# Altium schematic sheet RelayBypass.SchDoc
size A4; Author: Jeremiah Lilland; CompanyName: Pinebox Effects; DrawnBy: Jeremiah Lilland; Revision: 1.0
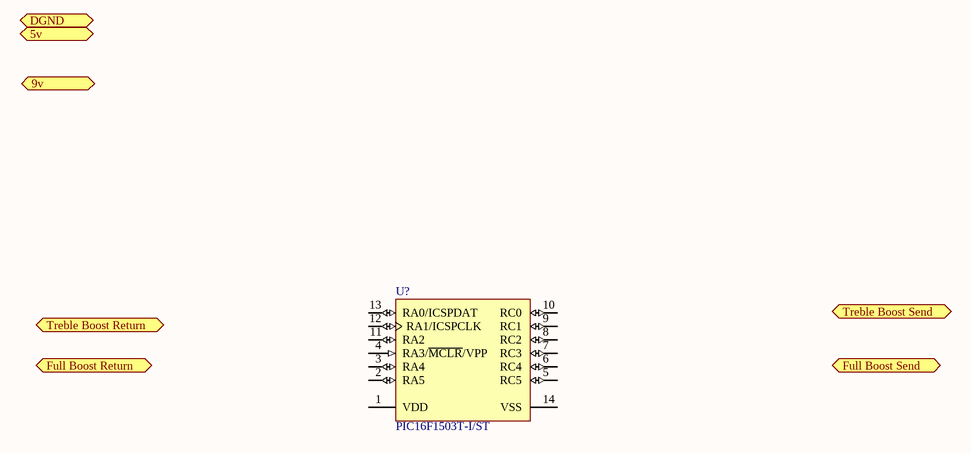
[diagram p0: RelayBypass.SchDoc]

## Parts
U?  PIC16F1503T-I/ST  [MCHP-TSSOP-ST14_N]

## Ports
5v, 9v (bidir), DGND, Full Boost Return (in), Full Boost Send (out), Treble Boost Return (in), Treble Boost Send (out)

## Nets

Not connected (* = marked no-connect by the designer): U? 1(VDD) 2(RA5) 3(RA4) 4(RA3/~{MCLR}/VPP) 5(RC5) 6(RC4) 7(RC3) 8(RC2) 9(RC1) 10(RC0) 11(RA2) 12(RA1/ICSPCLK) 13(RA0/ICSPDAT) 14(VSS)

## Notes on the sheet
- Sheet Title:
- Project Title:
- Date:
- Revision:
- Sheet
- of
- File:

## Library data of the parts
U? = PIC16F1503T-I/ST: Flash, 8-Bit Microcontroller, 20 MHz, 11 I/O, -40 to 85 degC, 14-pin TSSOP (ST14), Tape and Reel; Manufacturer: Microchip; # of A/D Channels: 8; Digital Communication: 1 -MSSP(SPI/I2C); I/O Pins: 11; Internal Oscillator: 16 MHz, 31 kHz; Max. CPU Speed MHz: 20; Operation Voltage Range: 2.3V - 5.5V; Packing: T/R; Program Memory KBytes: 3.5; Program Memory KWords: 2; RAM: 128; Timers: 2 - 8-bit, 1 - 16-bit; DatasheetVersion: Rev. A; PackageVersion: C04-087C, 12/2012; PackageReference: TSSOP-ST14; PackageDescription: 14-Lead Plastic Thin Shrink Small Outline, 5 x 4.4 mm Body, 0.65 mm Pitch; Supplier 1: Digi-Key; Supplier Part Number 1: PIC16F1503T-I/ST-ND; Supplier 2: Newark; Supplier Part Number 2: 55T3638; Supplier 3: Mouser; Supplier Part Number 3: 579-PIC16F1503T-I/ST; Memory Type: Flash; RoHS: TRUE; Mounting Technology: Surface Mount; PartNumber: PIC16F1503T-I/ST; ComponentLink1Description: Datasheet; ComponentLink1URL: http://ww1.microchip.com/downloads/en/DeviceDoc/41607A.pdf; ComponentLink2Description: Package Specification; ComponentLink2URL: http://www.microchip.com/stellent/groups/techpub_sg/documents/packagingspec/en012702.pdf; ComponentLink3Description: URL Link1; ComponentLink3URL: Product URL:http://www.microchip.com/datasheet/PIC16F1503